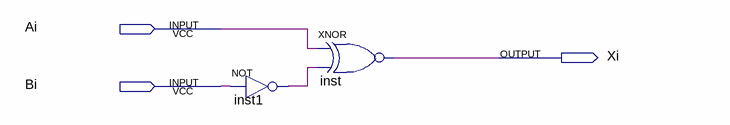
[diagram p0: schematic sheet]
// Quartus schematic Xi.bdf as structural Verilog: 2 symbols, 3 pins
module Xi (
  input  Ai,
  input  Bi,
  output Xi
);

  wire inst1_out;

  not inst1 (inst1_out, Bi);
  xnor inst (Xi, Ai, inst1_out);
endmodule
